# EAGLE schematic CoProcessor (EAGLE 9.2.2)

## Sheet 1 of 3: Connectors
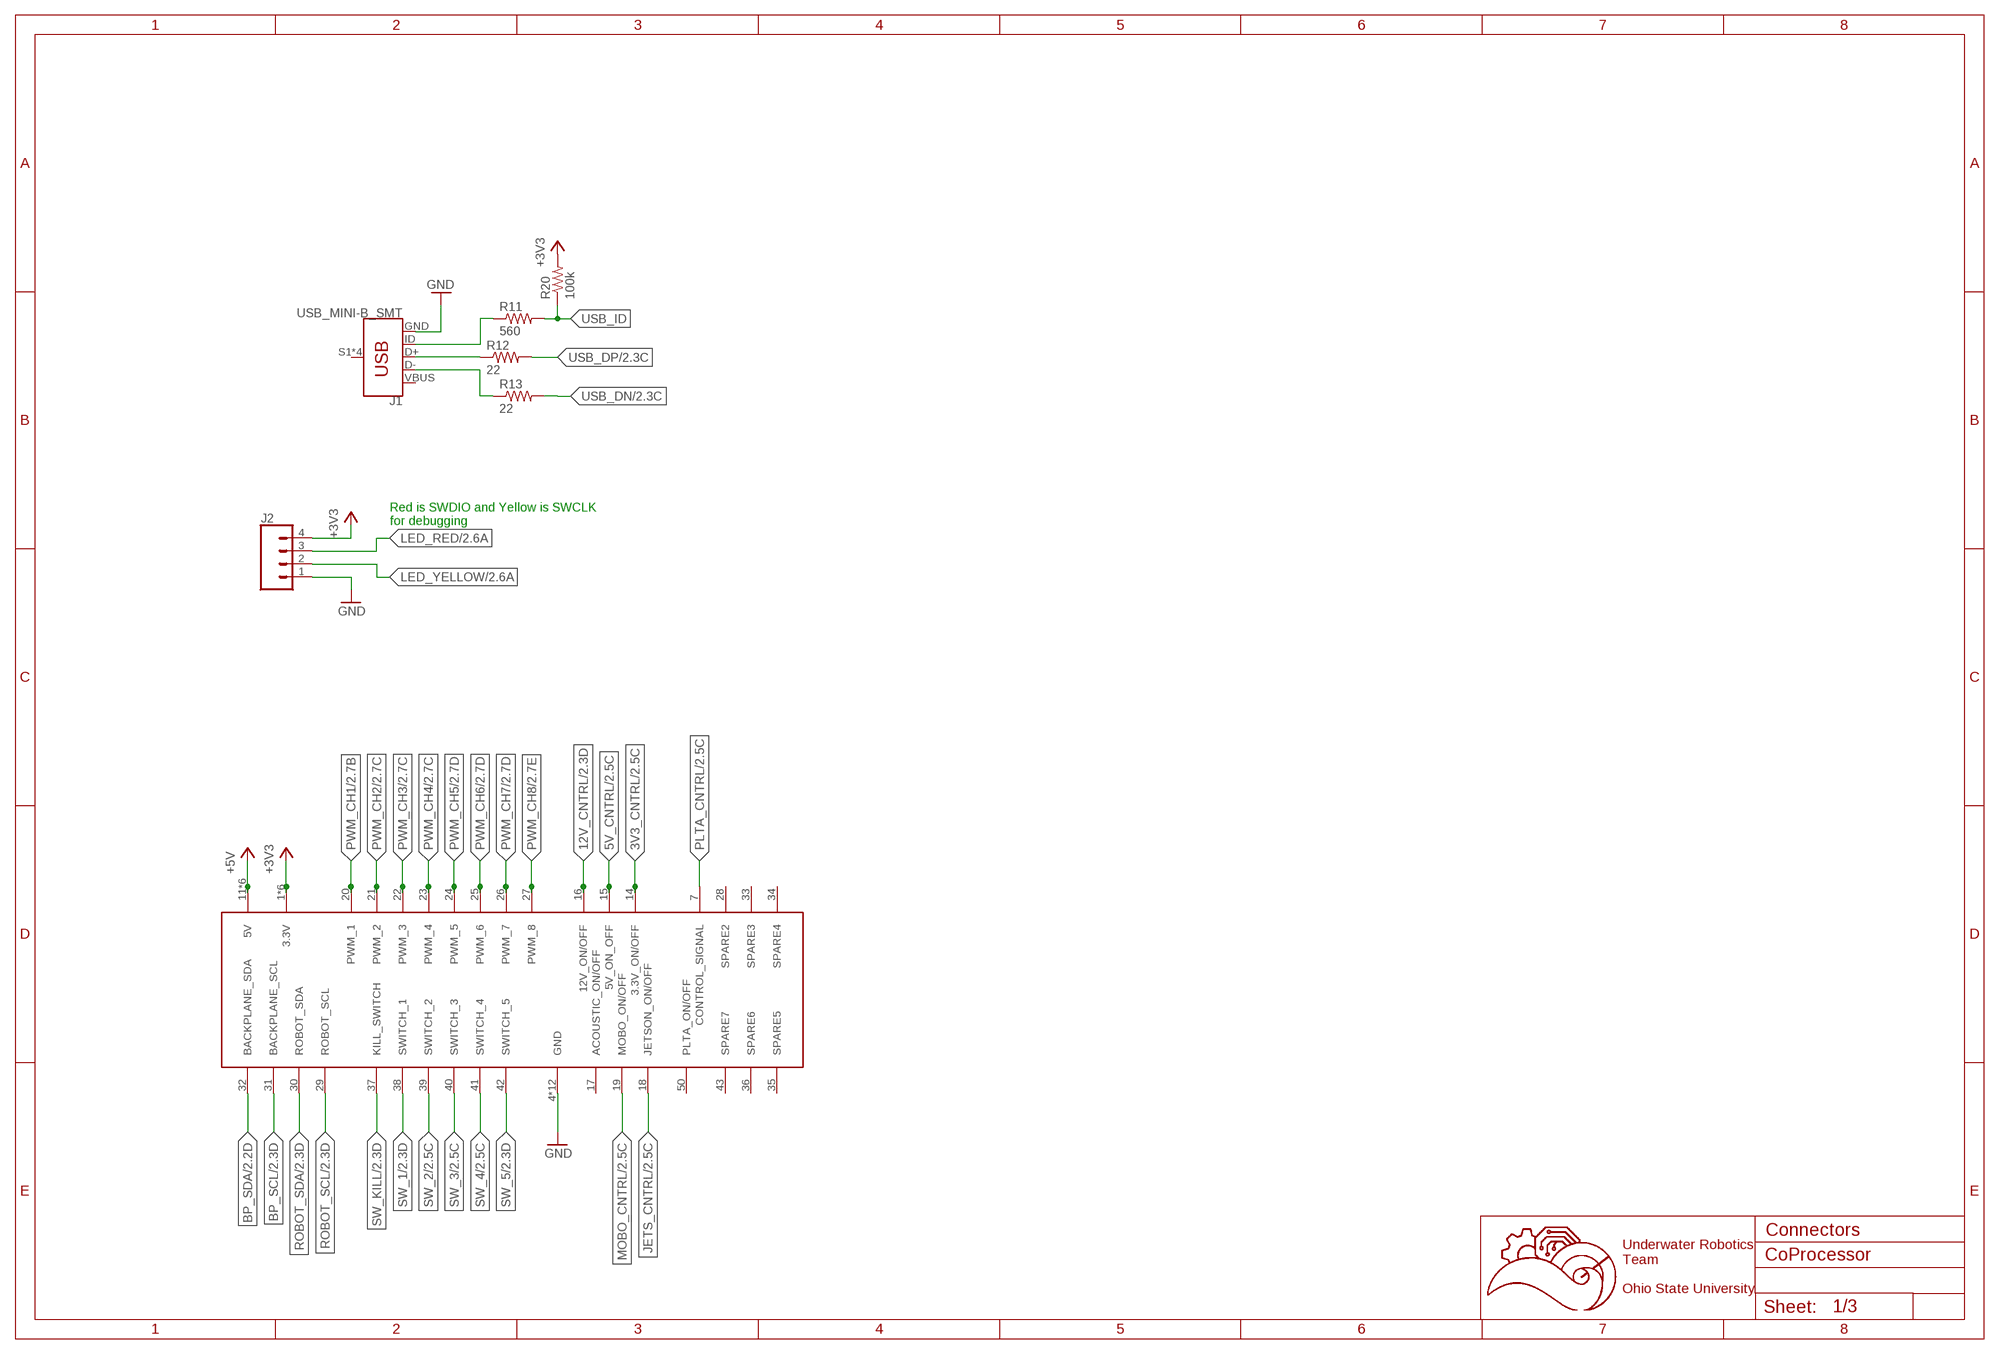
[diagram p0: schematic, sheet 1]

### Parts
J1  USB_MINI-B_SMT  [USB-MINIB]
J2  CONN_04  [1X04]
R11  560  R-US_R0603  [R0603]
R12  22  R-US_R0603  [R0603]
R13  22  R-US_R0603  [R0603]
R20  100k  R-US_R0603  [R0603]
U$1  5530843-EDGE  [5530843-6-BOARDFINGERS]

### Nets
3V3_CNTRL: U$1.14(3.3V_ON/OFF) ; also sheet 2
5V_CNTRL: U$1.15(5V_ON_OFF) ; also sheet 2
12V_CNTRL: U$1.16(12V_ON/OFF) ; also sheet 2
+3V3: J2.4 R20.2 U$1.1(3.3V) U$1.2(3.3V) U$1.3(3.3V) U$1.54(3.3V) U$1.55(3.3V) U$1.56(3.3V) ; also sheet 2,3
+5V: U$1.11(5V) U$1.12(5V) U$1.13(5V) U$1.44(5V) U$1.45(5V) U$1.46(5V)
BP_SCL: U$1.31(BACKPLANE_SCL) ; also sheet 2
BP_SDA: U$1.32(BACKPLANE_SDA) ; also sheet 2
GND: J1.GND J2.1 U$1.4(GND) U$1.5(GND) U$1.6(GND) U$1.8(GND) U$1.9(GND) U$1.10(GND) U$1.47(GND) U$1.48(GND) U$1.49(GND) U$1.51(GND) U$1.52(GND) U$1.53(GND) ; also sheet 2,3
JETS_CNTRL: U$1.18(JETSON_ON/OFF) ; also sheet 2
LED_RED: J2.3 ; also sheet 2
LED_YELLOW: J2.2 ; also sheet 2
MOBO_CNTRL: U$1.19(MOBO_ON/OFF) ; also sheet 2
N$2: J1.ID R11.1
N$4: J1.D+ R12.1
N$5: J1.D- R13.1
PLTA_CNTRL: U$1.7(CONTROL_SIGNAL) ; also sheet 2
PWM_CH1: U$1.20(PWM_1) ; also sheet 2
PWM_CH2: U$1.21(PWM_2) ; also sheet 2
PWM_CH3: U$1.22(PWM_3) ; also sheet 2
PWM_CH4: U$1.23(PWM_4) ; also sheet 2
PWM_CH5: U$1.24(PWM_5) ; also sheet 2
PWM_CH6: U$1.25(PWM_6) ; also sheet 2
PWM_CH7: U$1.26(PWM_7) ; also sheet 2
PWM_CH8: U$1.27(PWM_8) ; also sheet 2
ROBOT_SCL: U$1.29(ROBOT_SCL) ; also sheet 2
ROBOT_SDA: U$1.30(ROBOT_SDA) ; also sheet 2
SW_1: U$1.38(SWITCH_1) ; also sheet 2
SW_2: U$1.39(SWITCH_2) ; also sheet 2
SW_3: U$1.40(SWITCH_3) ; also sheet 2
SW_4: U$1.41(SWITCH_4) ; also sheet 2
SW_5: U$1.42(SWITCH_5) ; also sheet 2
SW_KILL: U$1.37(KILL_SWITCH) ; also sheet 2
USB_DN: R13.2 ; also sheet 2
USB_DP: R12.2 ; also sheet 2
USB_ID: R11.2 R20.1
Unconnected: J1.S1(SHIELD) J1.S2(SHIELD) J1.S3(SHIELD) J1.S4(SHIELD) U$1.17(ACOUSTIC_ON/OFF) U$1.28(SPARE2) U$1.33(SPARE3) U$1.34(SPARE4) U$1.35(SPARE5) U$1.36(SPARE6) U$1.43(SPARE7) U$1.50(PLTA_ON/OFF)

### Notes on the sheet
- Red is SWDIO and Yellow is SWCLK
  for debugging
- Connectors
- Underwater Robotics
  Team
  
  Ohio State University

## Sheet 2 of 3: MCU
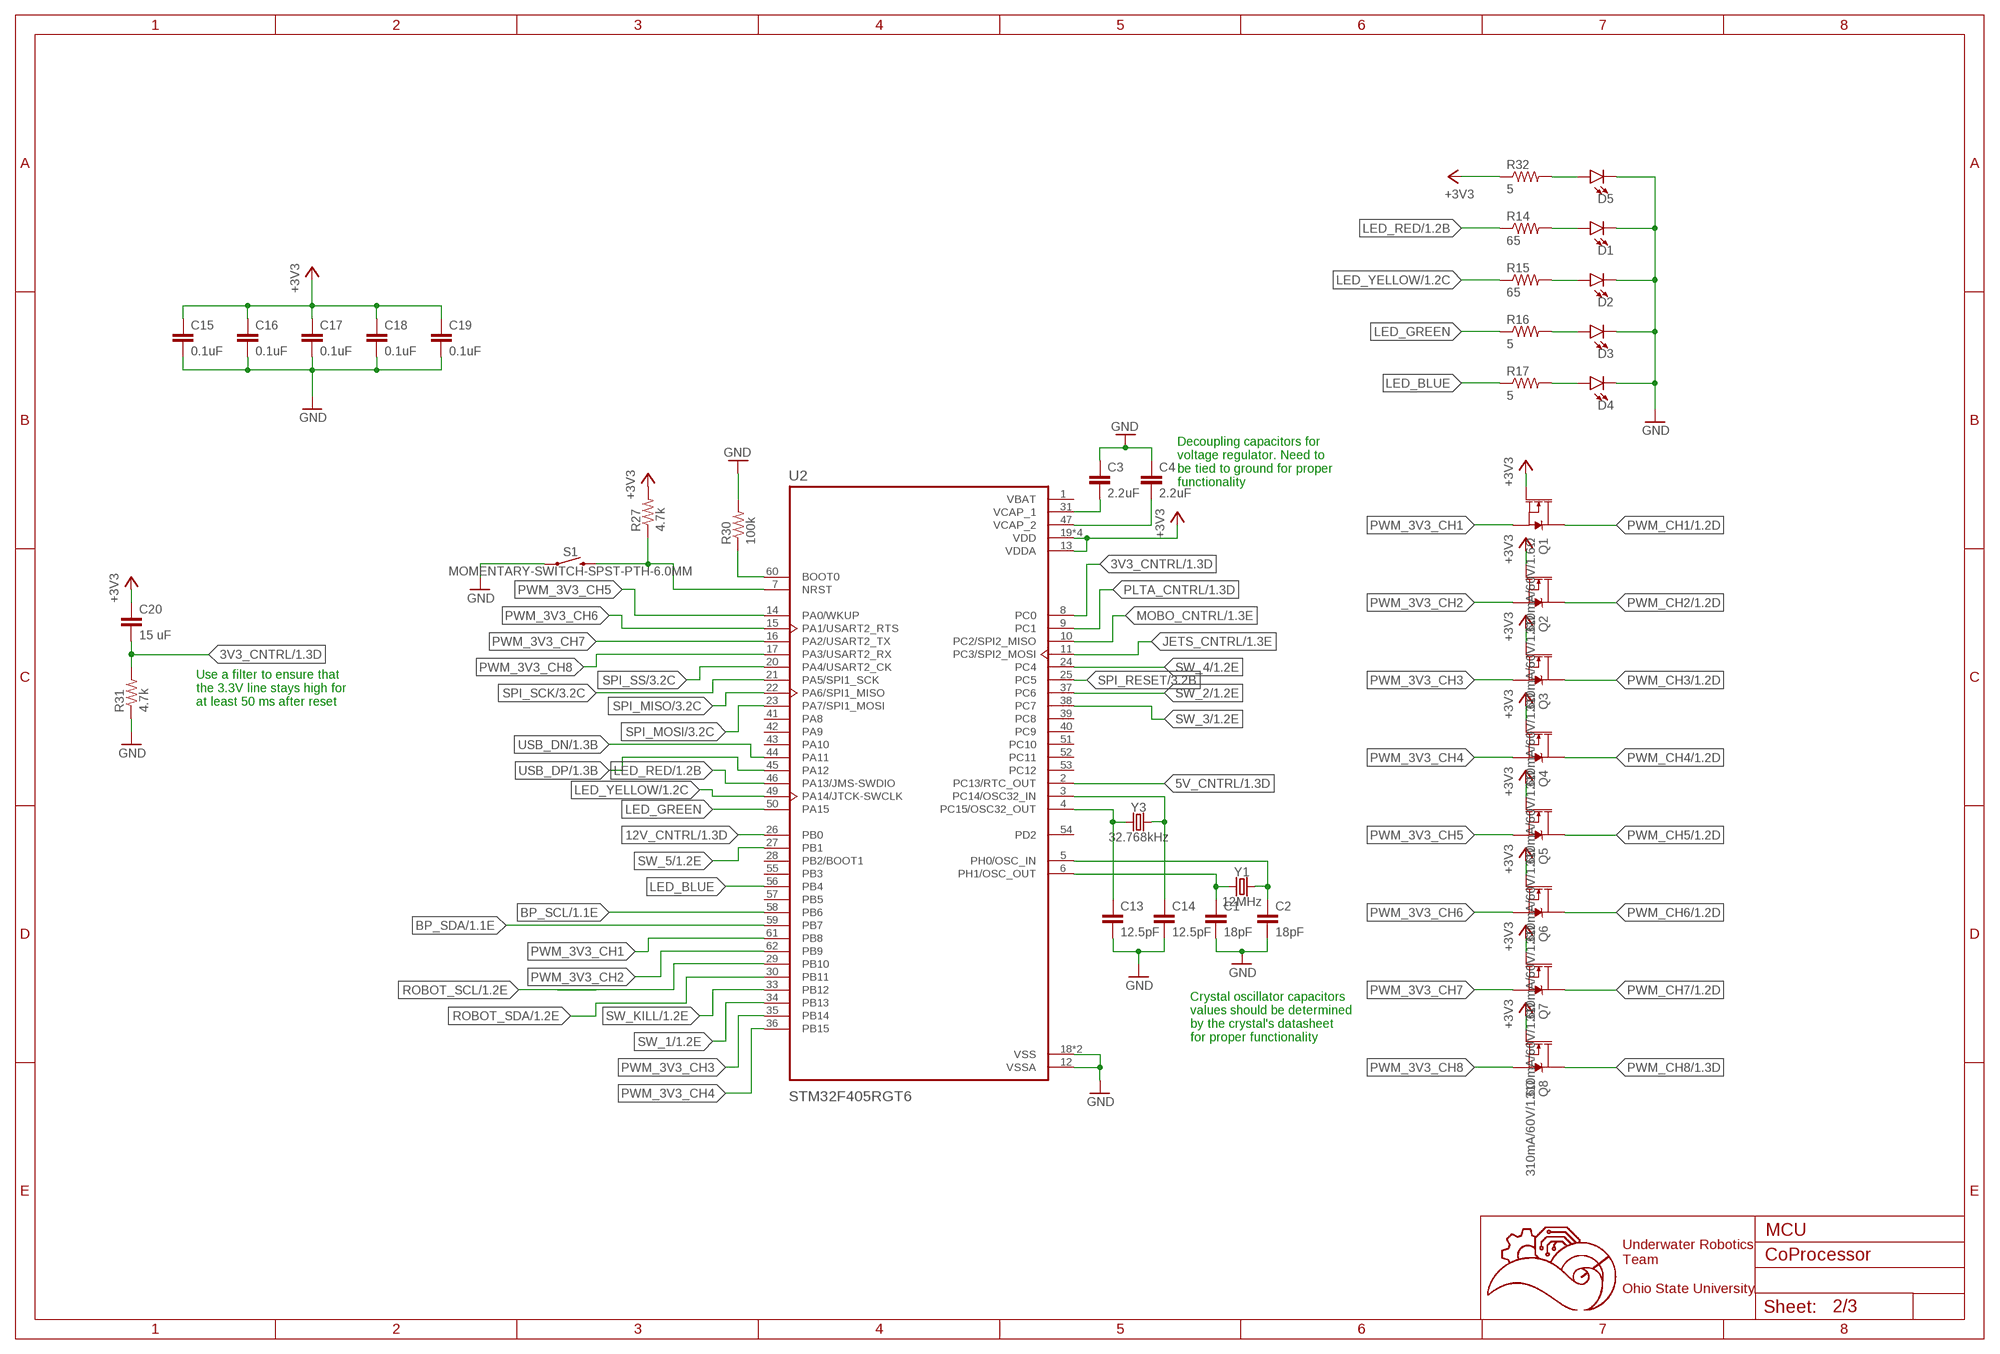
[diagram p1: schematic, sheet 2]

### Parts
C1  18pF  C-EUC0603  [C0603]
C2  18pF  C-EUC0603  [C0603]
C3  2.2uF  C-EUC0603  [C0603]
C4  2.2uF  C-EUC0603  [C0603]
C13  12.5pF  C-EUC0603  [C0603]
C14  12.5pF  C-EUC0603  [C0603]
C15  0.1uF  C-EUC0603  [C0603]
C16  0.1uF  C-EUC0603  [C0603]
C17  0.1uF  C-EUC0603  [C0603]
C18  0.1uF  C-EUC0603  [C0603]
C19  0.1uF  C-EUC0603  [C0603]
C20  15 uF  C-EU050-025X075  [C050-025X075]
D1  LED0603  [LED-0603]
D2  LED0603  [LED-0603]
D3  LED0603  [LED-0603]
D4  LED0603  [LED-0603]
D5  LED0603  [LED-0603]
Q1  310mA/60V/1.6Ω  MOSFET-NCH-2N7002PW  [SOT323]
Q2  310mA/60V/1.6Ω  MOSFET-NCH-2N7002PW  [SOT323]
Q3  310mA/60V/1.6Ω  MOSFET-NCH-2N7002PW  [SOT323]
Q4  310mA/60V/1.6Ω  MOSFET-NCH-2N7002PW  [SOT323]
Q5  310mA/60V/1.6Ω  MOSFET-NCH-2N7002PW  [SOT323]
Q6  310mA/60V/1.6Ω  MOSFET-NCH-2N7002PW  [SOT323]
Q7  310mA/60V/1.6Ω  MOSFET-NCH-2N7002PW  [SOT323]
Q8  310mA/60V/1.6Ω  MOSFET-NCH-2N7002PW  [SOT323]
R14  65  R-US_R0603  [R0603]
R15  65  R-US_R0603  [R0603]
R16  5  R-US_R0603  [R0603]
R17  5  R-US_R0603  [R0603]
R27  4.7k  R-US_R0603  [R0603]
R30  100k  R-US_R0603  [R0603]
R31  4.7k  R-US_R0603  [R0603]
R32  5  R-US_R0603  [R0603]
S1  MOMENTARY-SWITCH-SPST-PTH-6.0MM  [TACTILE_SWITCH_PTH_6.0MM]
U2  STM32F405RGT6  [QFP50P1200X1200X160-64N]
Y1  12MHz  CRYSTAL-16MHZPTH-HC49US  [HC49US]
Y3  32.768kHz  CRYSTAL-32.768KHZSMD-3.2X1.5  [CRYSTAL-SMD-3.2X1.5MM]

### Nets
3V3_CNTRL: C20.2 R31.2 U2.8(PC0) ; also sheet 1
5V_CNTRL: U2.2(PC13/RTC_OUT) ; also sheet 1
12V_CNTRL: U2.26(PB0) ; also sheet 1
+3V3: C15.1 C16.1 C17.1 C18.1 C19.1 C20.1 Q1.1(G) Q2.1(G) Q3.1(G) Q4.1(G) Q5.1(G) Q6.1(G) Q7.1(G) Q8.1(G) R27.2 R32.1 U2.13(VDDA) U2.19(VDD) U2.32(VDD) U2.48(VDD) U2.64(VDD) ; also sheet 1,3
BP_SCL: U2.58(PB6) ; also sheet 1
BP_SDA: U2.59(PB7) ; also sheet 1
GND: C1.2 C2.2 C3.1 C4.1 C13.2 C14.2 C15.2 C16.2 C17.2 C18.2 C19.2 D1.C D2.C D3.C D4.C D5.C R30.2 R31.1 S1.1 U2.12(VSSA) U2.18(VSS) U2.63(VSS) ; also sheet 1,3
JETS_CNTRL: U2.11(PC3/SPI2_MOSI) ; also sheet 1
LED_BLUE: R17.1 U2.56(PB4)
LED_GREEN: R16.1 U2.50(PA15)
LED_RED: R14.1 U2.46(PA13/JMS-SWDIO) ; also sheet 1
LED_YELLOW: R15.1 U2.49(PA14/JTCK-SWCLK) ; also sheet 1
MOBO_CNTRL: U2.10(PC2/SPI2_MISO) ; also sheet 1
N$1: C1.1 U2.6(PH1/OSC_OUT) Y1.1
N$3: D1.A R14.2
N$6: D2.A R15.2
N$7: D3.A R16.2
N$8: D4.A R17.2
N$9: C2.1 U2.5(PH0/OSC_IN) Y1.2
N$10: C4.2 U2.47(VCAP_2)
N$11: C3.2 U2.31(VCAP_1)
N$15: C13.1 U2.4(PC15/OSC32_OUT) Y3.P$1
N$29: C14.1 U2.3(PC14/OSC32_IN) Y3.P$2
N$30: R30.1 U2.60(BOOT0)
N$31: D5.A R32.2
N$34: R27.1 S1.3 U2.7(NRST)
PLTA_CNTRL: U2.9(PC1) ; also sheet 1
PWM_3V3_CH1: Q1.2(S) U2.61(PB8)
PWM_3V3_CH2: Q2.2(S) U2.62(PB9)
PWM_3V3_CH3: Q3.2(S) U2.35(PB14)
PWM_3V3_CH4: Q4.2(S) U2.36(PB15)
PWM_3V3_CH5: Q5.2(S) U2.14(PA0/WKUP)
PWM_3V3_CH6: Q6.2(S) U2.15(PA1/USART2_RTS)
PWM_3V3_CH7: Q7.2(S) U2.16(PA2/USART2_TX)
PWM_3V3_CH8: Q8.2(S) U2.17(PA3/USART2_RX)
PWM_CH1: Q1.3(D) ; also sheet 1
PWM_CH2: Q2.3(D) ; also sheet 1
PWM_CH3: Q3.3(D) ; also sheet 1
PWM_CH4: Q4.3(D) ; also sheet 1
PWM_CH5: Q5.3(D) ; also sheet 1
PWM_CH6: Q6.3(D) ; also sheet 1
PWM_CH7: Q7.3(D) ; also sheet 1
PWM_CH8: Q8.3(D) ; also sheet 1
ROBOT_SCL: U2.29(PB10) ; also sheet 1
ROBOT_SDA: U2.30(PB11) ; also sheet 1
SPI_MISO: U2.22(PA6/SPI1_MISO) ; also sheet 3
SPI_MOSI: U2.23(PA7/SPI1_MOSI) ; also sheet 3
SPI_RESET: U2.25(PC5) ; also sheet 3
SPI_SCK: U2.21(PA5/SPI1_SCK) ; also sheet 3
SPI_SS: U2.20(PA4/USART2_CK) ; also sheet 3
SW_1: U2.34(PB13) ; also sheet 1
SW_2: U2.37(PC6) ; also sheet 1
SW_3: U2.38(PC7) ; also sheet 1
SW_4: U2.24(PC4) ; also sheet 1
SW_5: U2.27(PB1) ; also sheet 1
SW_KILL: U2.33(PB12) ; also sheet 1
USB_DN: U2.44(PA11) ; also sheet 1
USB_DP: U2.45(PA12) ; also sheet 1
Unconnected: U2.28(PB2/BOOT1) U2.39(PC8) U2.40(PC9) U2.41(PA8) U2.42(PA9) U2.43(PA10) U2.51(PC10) U2.52(PC11) U2.53(PC12) U2.54(PD2) U2.55(PB3) U2.57(PB5)

### Notes on the sheet
- Decoupling capacitors for 
  voltage regulator. Need to
  be tied to ground for proper
  functionality
- Use a filter to ensure that
  the 3.3V line stays high for
  at least 50 ms after reset
- Crystal oscillator capacitors
  values should be determined
  by the crystal's datasheet
  for proper functionality
- MCU
- Underwater Robotics
  Team
  
  Ohio State University

## Sheet 3 of 3: Ethernet
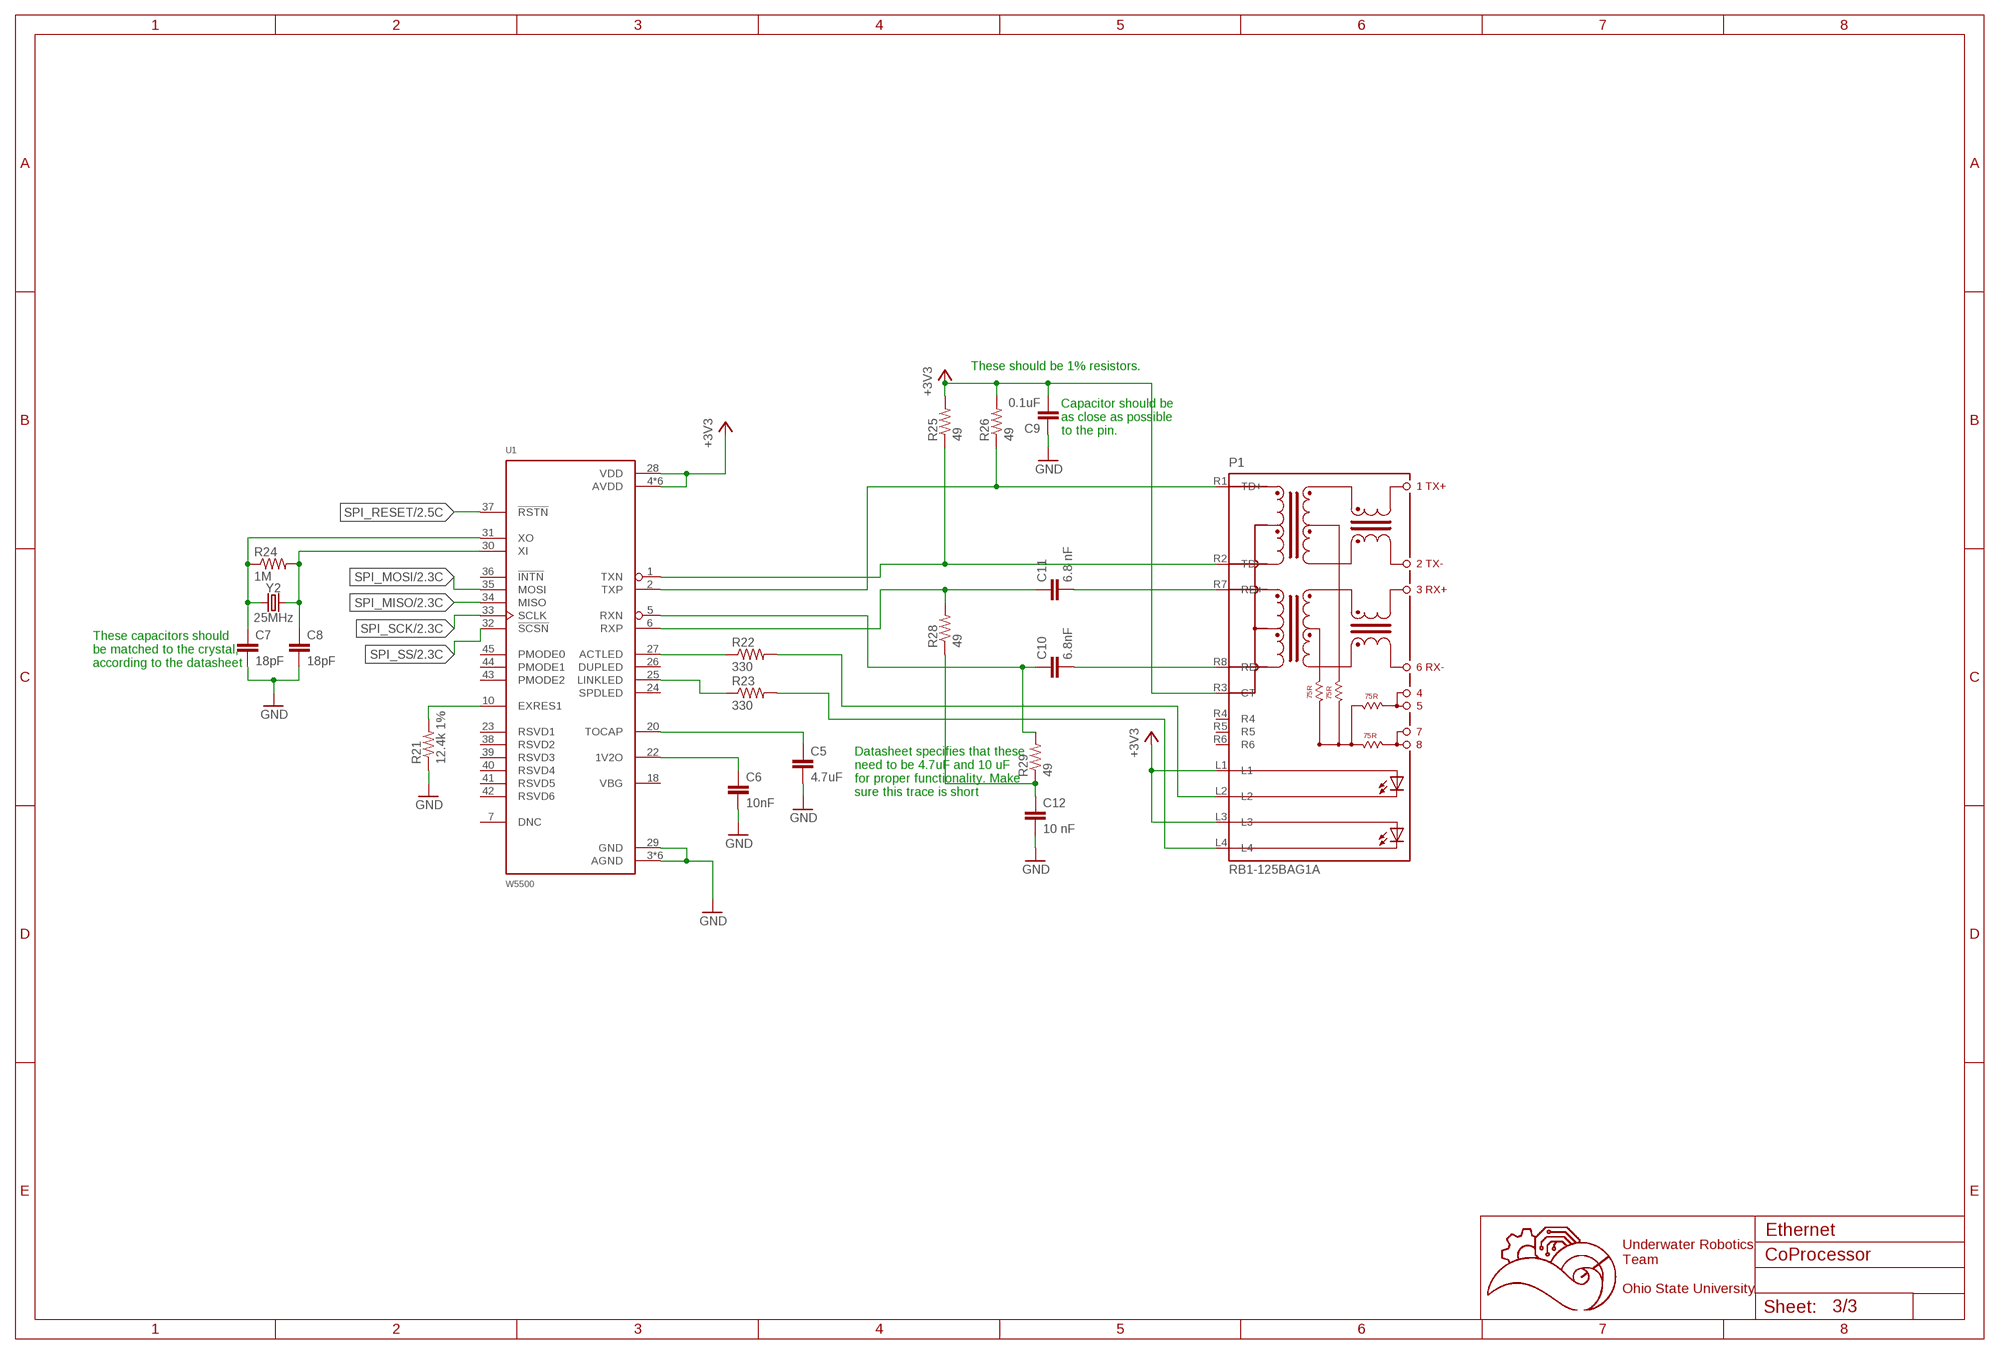
[diagram p2: schematic, sheet 3]

### Parts
C5  4.7uF  C-EUC0603  [C0603]
C6  10nF  C-EUC0603  [C0603]
C7  18pF  C-EUC0603  [C0603]
C8  18pF  C-EUC0603  [C0603]
C9  0.1uF  C-EUC0603  [C0603]
C10  6.8nF  C-EUC0603  [C0603]
C11  6.8 nF  C-EUC0603  [C0603]
C12  10 nF  C-EUC0603  [C0603]
P1  RB1-125BAG1A  [WIZNET_RB1-125BAG1A]
R21  12.4k 1%  R-US_R0603  [R0603]
R22  330  R-US_R0603  [R0603]
R23  330  R-US_R0603  [R0603]
R24  1M  R-US_R0603  [R0603]
R25  49  R-US_R0603  [R0603]
R26  49  R-US_R0603  [R0603]
R28  49  R-US_R0603  [R0603]
R29  49  R-US_R0603  [R0603]
U1  W5500  [QFP50P900X900X160-48N]
Y2  25MHz  CRYSTALPTH-HC49US  [HC49US]

### Nets
+3V3: C9.2 P1.L1 P1.L3 P1.R3(CT) R25.2 R26.2 U1.4(AVDD) U1.8(AVDD) U1.11(AVDD) U1.15(AVDD) U1.17(AVDD) U1.21(AVDD) U1.28(VDD) ; also sheet 1,2
GND: C5.2 C6.2 C7.2 C8.2 C9.1 C12.2 R21.1 U1.3(AGND) U1.9(AGND) U1.14(AGND) U1.16(AGND) U1.19(AGND) U1.29(GND) U1.48(AGND) ; also sheet 1,2
N$12: C5.1 U1.20(TOCAP)
N$13: C6.1 U1.22(1V2O)
N$14: R21.2 U1.10(EXRES1)
N$16: P1.R2(TD-) R25.1 U1.1(TXN)
N$17: P1.R1(TD+) R26.1 U1.2(TXP)
N$18: C10.1 R29.2 U1.5(RXN)
N$19: C11.1 R28.2 U1.6(RXP)
N$20: P1.L2 R22.2
N$21: P1.L4 R23.2
N$22: R22.1 U1.27(ACTLED)
N$23: R23.1 U1.25(LINKLED)
N$24: C8.1 R24.2 U1.30(XI) Y2.2
N$25: C7.1 R24.1 U1.31(XO) Y2.1
N$26: C10.2 P1.R8(RD-)
N$27: C11.2 P1.R7(RD+)
N$28: C12.1 R28.1 R29.1
SPI_MISO: U1.34(MISO) ; also sheet 2
SPI_MOSI: U1.35(MOSI) ; also sheet 2
SPI_RESET: U1.37(!RSTN) ; also sheet 2
SPI_SCK: U1.33(SCLK) ; also sheet 2
SPI_SS: U1.32(!SCSN) ; also sheet 2
Unconnected: P1.R4 P1.R5 P1.R6 U1.7(DNC) U1.18(VBG) U1.23(RSVD1) U1.24(SPDLED) U1.26(DUPLED) U1.36(!INTN) U1.38(RSVD2) U1.39(RSVD3) U1.40(RSVD4) U1.41(RSVD5) U1.42(RSVD6) U1.43(PMODE2) U1.44(PMODE1) U1.45(PMODE0)

### Notes on the sheet
- These should be 1% resistors.
- Capacitor should be
  as close as possible
  to the pin.
- These capacitors should
  be matched to the crystal,
  according to the datasheet
- Datasheet specifies that these
  need to be 4.7uF and 10 uF
  for proper functionality. Make 
  sure this trace is short
- Ethernet
- Underwater Robotics
  Team
  
  Ohio State University

## Power pins joined to a net without a drawn wire
VBAT: U2.1(VBAT)
VBUS: J1.VBUS

## Library data of the parts
C1-C20 = rcl:C-EU: CAPACITOR, European symbol; SPICEPREFIX: C
D1-D5 = SparkFun-LED:LED: LED (Generic) Standard schematic elements and footprints for 5mm, 3mm, 1206, and 0603 sized LEDs. Generic LEDs with no color specified.
J1 = SparkFun-Connectors:USB_MINI-B: USB type Mini-B Connector Breaks out 5th pin, and includes shield pins if needed. SparkFun Products: SparkFun FTDI Basic Breakout <https://www.sparkfun.com/products/9716> SparkFun XBee Explorer USB <https://www.sparkfun.com/products/11812> SparkFun Redboard <https://www.sparkfun.com/products/12757>; PROD_ID: CONN-08193; SF_ID: PRT-00587
J2 = SparkFun-Connectors:CONN_04: Multi connection point. Often used as Generic Header-pin footprint for 0.1 inch spaced/style header connections On any of the 0.1 inch spaced packages, you can populate with these: Break Away Headers - Straight <https://www.sparkfun.com/products/116> (PRT-00116) Break Away Male Headers - Right Angle <https://www.sparkfun.com/products/553> (PRT-00553) Female Headers <https://www.sparkfun.com/products/115> (PRT-00115) Break Away Headers - Machine Pin <https://www.sparkfun.com/products/117> (PRT-00117) Break Away Female Headers - Swiss Machine Pin <https://www.sparkfun.com/products/743> (PRT-00743) For SCREWTERMINALS and SPRING TERMINALS visit here: Screw Terimnals on SparkFun.com <https://www.sparkfun.com/search/results?term=Screw+Terminals> (5mm/3.5mm/2.54mm spacing) This device is also useful as a general connection point to wire up your design to another part of your project. Our various solder wires solder well into these plated through hole pads. Hook-Up Wire - Assortment (Stranded, 22 AWG) <https://www.sparkfun.com/products/11375> (PRT-11375) Hook-Up Wire - Assortment (Solid Core, 22 AWG) <https://www.sparkfun.com/products/11367> (PRT-11367) View the entire wire category on our website here <https://www.sparkfun.com/categories/141> Special notes: Molex polarized connector foot print use with SKU : PRT-08231 with associated crimp pins and housings. 1MM SMD Version SKU: PRT-10208; PROD_ID: CONN-09696
P1 = RJ45-MAGJACK:RB1-125BAG1A: Accessory RJ-45 With Transformer Connector - UDE; AVAILABILITY: Unavailable; DESCRIPTION: Accessory RJ-45 With Transformer Connector - UDE; MF: WIZnet; MP: RB1-125BAG1A; PACKAGE: HVQFN-36 NXP Semiconductors; PRICE: None
Q1-Q8 = SparkFun-DiscreteSemi:MOSFET-NCH: N-channel MOSFETs Voltage controlled devices that allow control of high current outputs. SparkFun Products: SparkFun OpenScale <https://www.sparkfun.com/products/13261> SparkFun Digital Sandbox <https://www.sparkfun.com/products/12651> SparkFun Monster Moto Shield <https://www.sparkfun.com/products/10182> SparkFun MOSFET Power Controller <https://www.sparkfun.com/products/11214>; PROD_ID: TRANS-11151
R11-R17 R20-R32 = rcl:R-US_: RESISTOR, American symbol; SPICEPREFIX: R
S1 = SparkFun-Switches:MOMENTARY-SWITCH-SPST: Momentary Switch (Pushbutton) - SPST Normally-open (NO) SPST momentary switches (buttons, pushbuttons). Variants PTH-12MM - 12mm square, through-hole Momentary Pushbutton Switch - 12mm Square <https://www.sparkfun.com/products/9190> (COM-09190) PTH-6.0MM, PTH-6.0MM-KIT - 6.0mm square, through-hole Mini Pushbutton Switch <https://www.sparkfun.com/products/97> (COM-00097) KIT package intended for soldering kit's - only one side of pads' copper is exposed. PTH-RIGHT-ANGLE-KIT - Right-angle, through-hole Right Angle Tactile Button <https://www.sparkfun.com/products/10791> - Used on SparkFun BigTime Watch Kit <https://www.sparkfun.com/products/11734> SMD-12MM - 12mm square, surface-mount Tactile Button - SMD (12mm) <https://www.sparkfun.com/products/12993> (COM-12993) Used on SparkFun PicoBoard <https://www.sparkfun.com/products/11888> SMD-4.5MM - 4.5mm Square Trackball Switch Used on SparkFun Blackberry Trackballer Breakout <https://www.sparkfun.com/products/13169> SMD-4.6MMX2.8MM - 4.60mm x 2.80mm, surface mount Used on SparkFun SAMD21 Mini Breakout <https://www.sparkfun.com/products/13664> SMD-5.2MM, SMD-5.2-REDUNDANT - 5.2mm square, surface-mount Mini Pushbutton Switch - SMD <https://www.sparkfun.com/products/8720> (COM-08720) Used on Arduino Pro Mini <https://www.sparkfun.com/products/11114> REDUNDANT package connects both switch circuits together SMD-6.0X3.5MM - 6.0 x 3.5mm, surface mount Momentary Reset Switch SMD <https://www.sparkfun.com/products/8229> (COM-08229) SMD-6.2MM-TALL - 6.2mm square, surface mount Tactile Button - SMD (6mm) <https://www.sparkfun.com/products/12992> Used on SparkFun Digital Sandbox <https://www.sparkfun.com/products/12651> SMD-RIGHT-ANGLE - Right-angle, surface mount Used on SparkFun Block for Intel® Edison - Arduino <https://www.sparkfun.com/products/13036>; PROD_ID: SWCH-08441; SF_SKU: COM-00097
U1 = W5500:W5500: Hardwired TCP/IP embedded Ethernet controller; AVAILABILITY: Unavailable; DESCRIPTION: Victor Pure White Collection Wood Tidy Tower Organizer; MF: WIZnet; MP: W5500; PACKAGE: LQFP-48 Victor Technologies; PRICE: None
U2 = STM32F405RGT6:STM32F405RGT6: High-performance foundation line, ARM Cortex-M4 core with DSP and FPU, 1 Mbyte Flash, 168 MHz CPU, ART Accelerator; AVAILABILITY: Unavailable; DESCRIPTION: High-performance foundation line, ARM Cortex-M4 core with DSP and FPU, 1 Mbyte Flash, 168 MHz CPU, ART Accelerator; MF: STMicroelectronics; MP: STM32F405RGT6; PACKAGE: LQFP-64 STMicroelectronics; PRICE: None
U$1 = 5530843-6:5530843-EDGE
Y1 = SparkFun-Clocks:CRYSTAL-16MHZ: 16MHz Crystal Digikey Example <http://www.digikey.com/product-search/en?keywords=535-9122-1-ND> Frequency: 16MHz Frequency Stability: ±50ppm Frequency Tolerance: ±20ppm Load Capacitance: 18pF SparkFun Products: Pro Micro -5V/16MHz <https://www.sparkfun.com/products/12640> SparkFun Serial Enabled LCD Kit <https://www.sparkfun.com/products/10097>; PROD_ID: XTAL-08181; SF_ID: COM-00536; VALUE: 16MHz
Y2 = SparkFun-Clocks:CRYSTAL: Crystals (Generic) These are passive quartz crystals, which can be used as a clock source for a microcontroller. Crystal's are two-terminal devices. They require external "load" capacitors to generate an oscillating signal.
Y3 = SparkFun-Clocks:CRYSTAL-32.768KHZ: 32.768kHz Crystal Frequency: 32.768kHz Frequency Stability: ±20ppm Load Capacitance: 12.5pF (PTH-2X6 & SMD-3.2X1.5), 6pF (SMD-2X6) SparkFun Products: SparkFun BigTime Watch Kit <https://www.sparkfun.com/products/11734> SparkFun nRF52832 Breakout <https://www.sparkfun.com/products/13990> SparkFun Real Time Clock Module <https://www.sparkfun.com/products/12708>; PROD_ID: XTAL-13062